# Altium schematic sheet electronic_dc_load_v1.SchDoc: Electronic DC Load (part 1 of 3)
size C; CompanyName: @naifaljohani; Engineer: Naif Aljohani; Revision: 1.1; SheetNumber: 1; SheetTotal: 1; Project: bb; ENG_APP_DATE: --/--/--; DSN_APP_DATE: --/--/--; CHK_APP_DATE: --/--/--
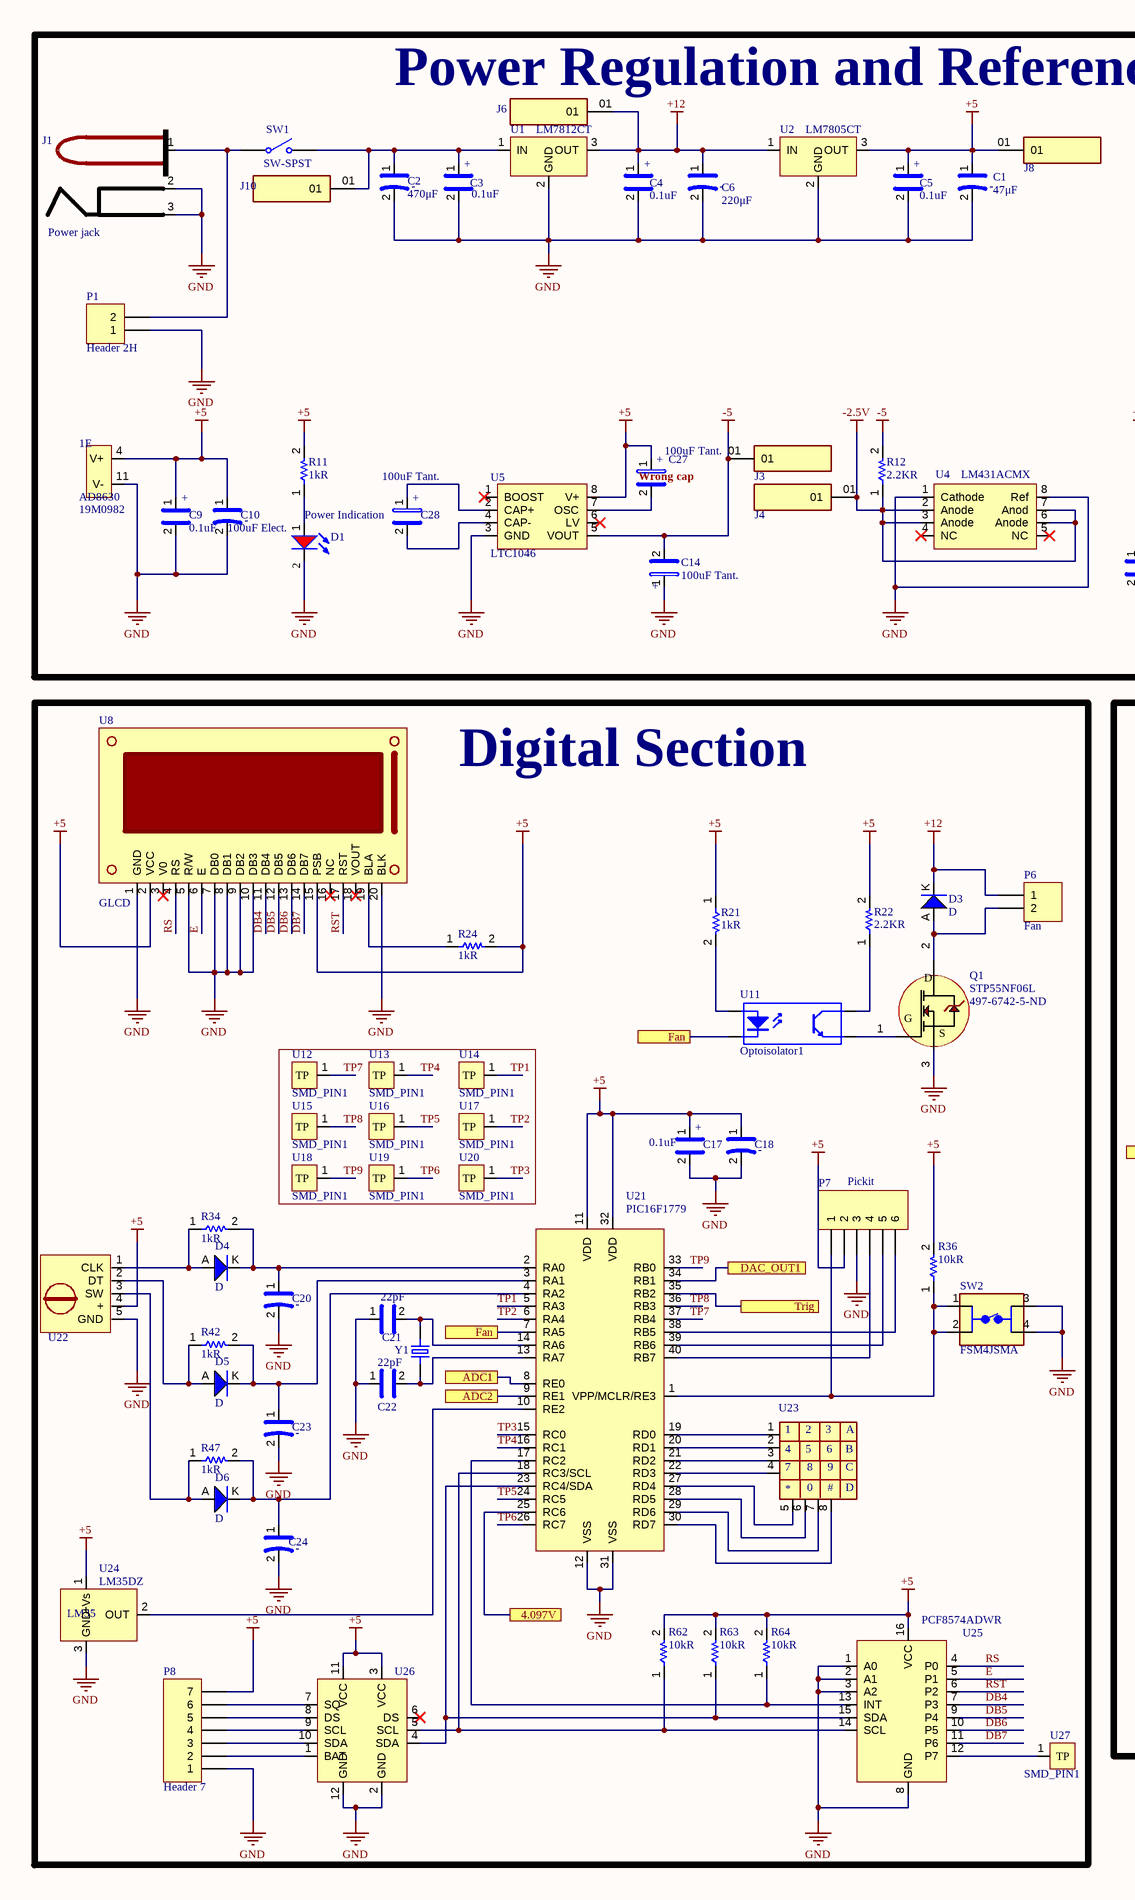
[diagram p0: electronic_dc_load_v1.SchDoc, left]
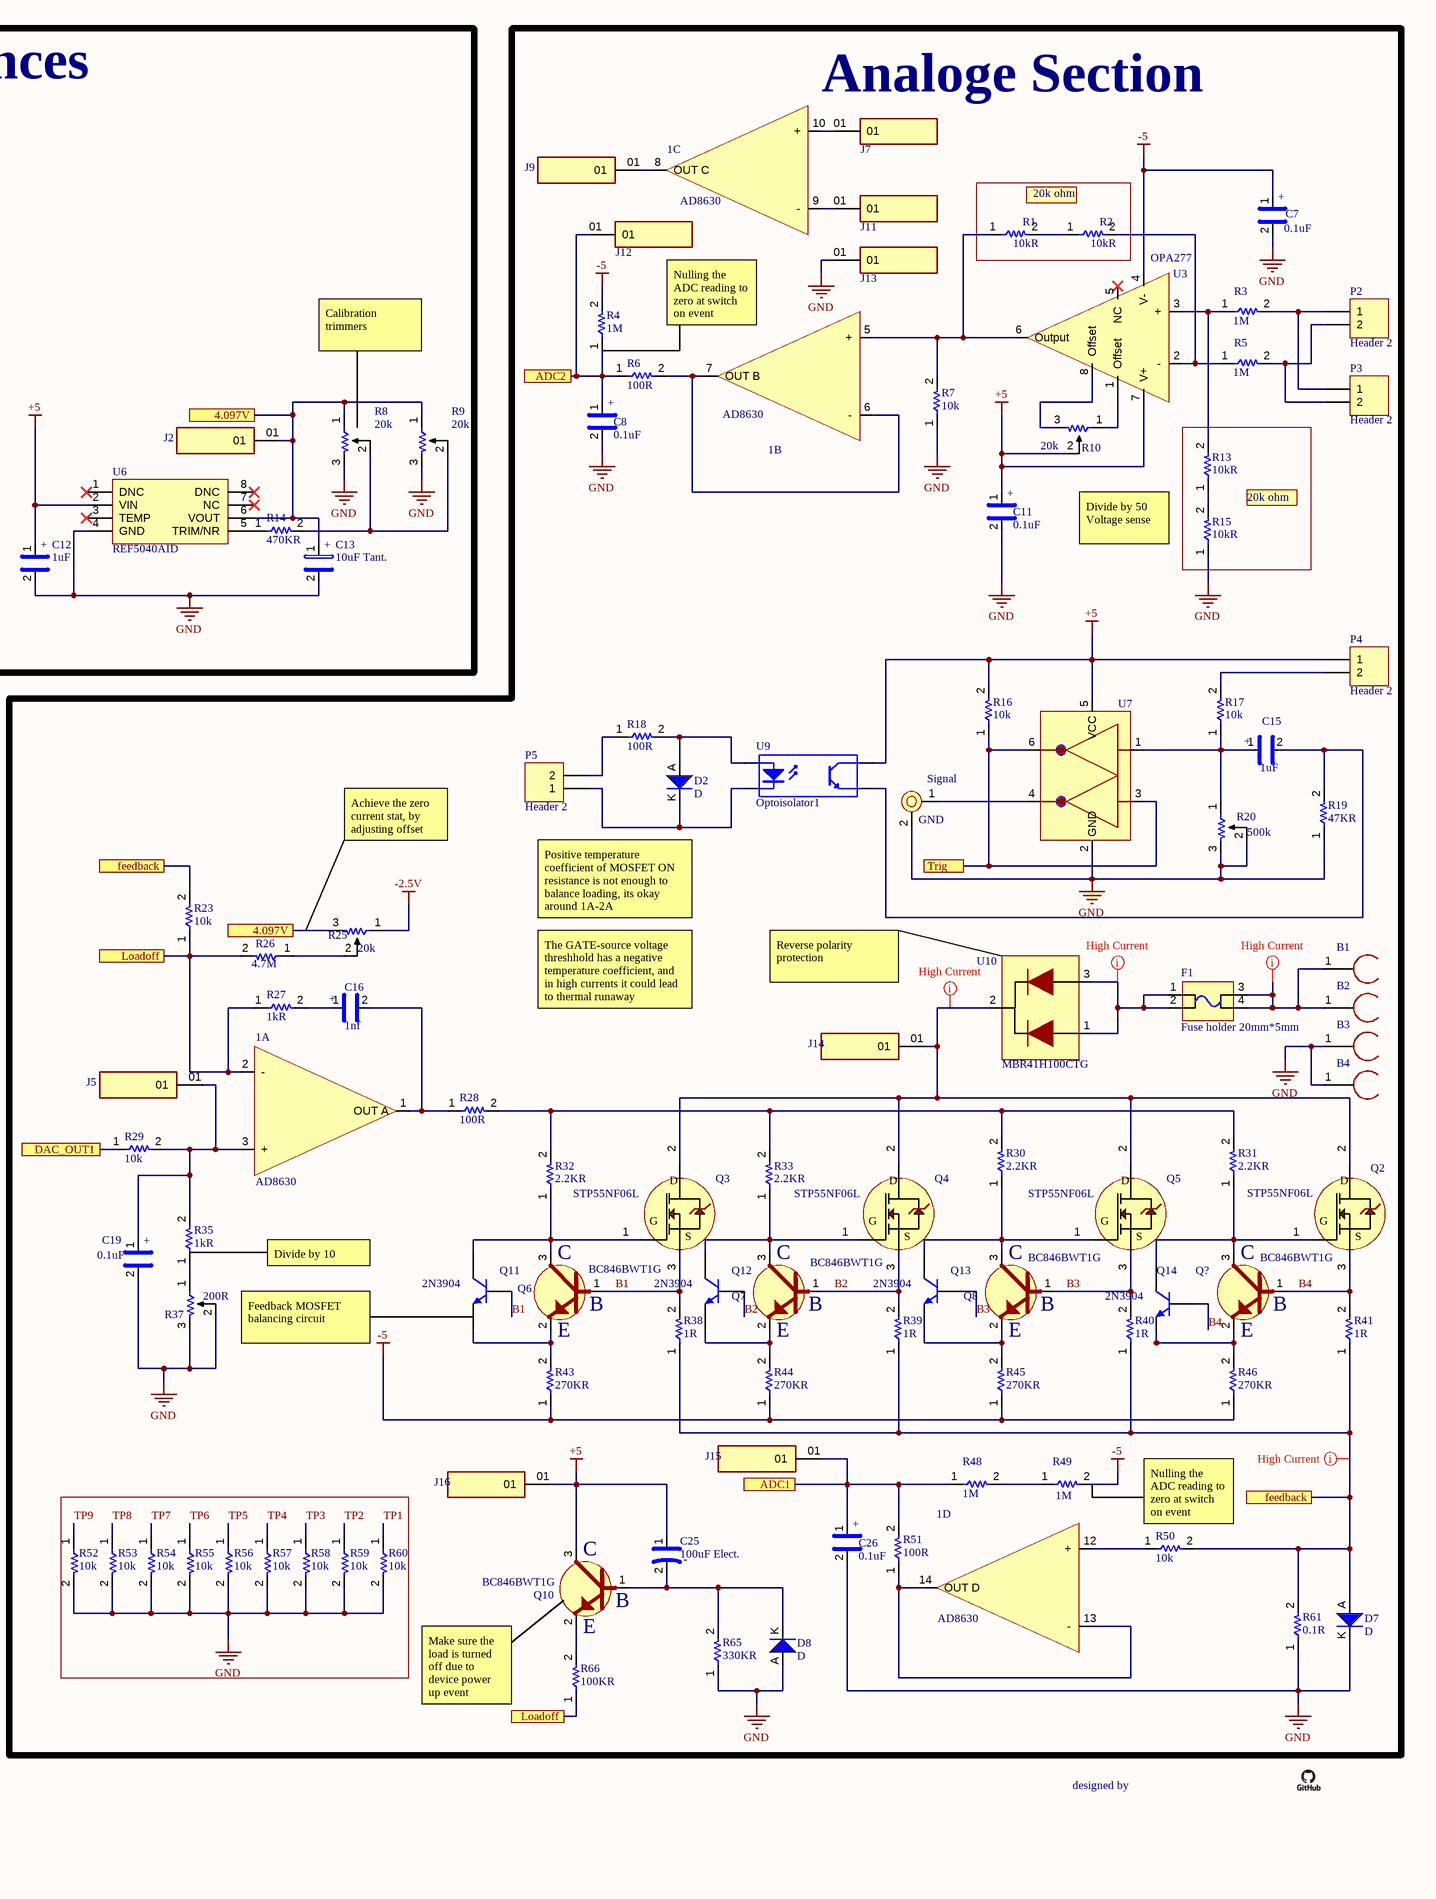
[diagram p1: electronic_dc_load_v1.SchDoc, right]

## Parts
1  AD8630  [SOIC127P600X265-14N]  (parts A,B,C,D,E of 5)
4  031-71052  [PNC-031-71052]  (value not drawn)
B1  BANANA JACK  [banana jack]  (value not drawn)
B2  BANANA JACK  [banana jack]  (value not drawn)
B3  BANANA JACK  [banana jack]  (value not drawn)
B4  BANANA JACK  [banana jack]  (value not drawn)
C1  47μF  [Capacitor-47uf]
C2  470μF  [Capacitor-470uf]
C3  0.1uF  [RESC2012X06N]
C4  0.1uF  [RESC2012X06N]
C5  0.1uF  [RESC2012X06N]
C6  220μF  [Capacitor-470uf]
C7  0.1uF  [RESC2012X06N]
C8  0.1uF  [RESC2012X06N]
C9  0.1uF  [RESC2012X06N]
C10  100uF Elect.  [CAPAE9183X102M]
C11  0.1uF  [RESC2012X06N]
C12  1uF  [RESC3216X06N]
C13  10uF Tant.  [CAPCP6032X20N-10uf Tant.]
C14  100uF Tant.  [CAPCP7343X24N-100uf Tant.]
C15  1uF  [RESC3216X06N]
C16  1nf  [R82EC1100AA50J]
C17  0.1uF  [RESC2012X06N]
C18  100uF Elect.  [CAPAE9183X102M]  (value not drawn)
C19  0.1uF  [RESC2012X06N]
C20  100uF Elect.  [CAPAE9183X102M]  (value not drawn)
C21  22pF  [CAPC3028X26N]
C22  22pF  [CAPC3028X26N]
C23  100uF Elect.  [CAPAE9183X102M]  (value not drawn)
C24  100uF Elect.  [CAPAE9183X102M]  (value not drawn)
C25  100uF Elect.  [CAPAE9183X102M]
C26  0.1uF  [RESC2012X06N]
C27  100uF Tant.  [CAPCP7343X24N-100uf Tant.]
C28  100uF Tant.  [CAPCP7343X24N-100uf Tant.]
D1  15-21SURC/S530-A3/TR8  [Diode]  (value not drawn)
D2  D  [Diode_Through hole]
D3  D  [Diode_Through hole]
D4  D  [Diode_Through hole]
D5  D  [Diode_Through hole]
D6  D  [Diode_Through hole]
D7  D  [Diode_Through hole]
D8  D  [Diode_Through hole]
F1  Fuse holder 20mm*5mm  [Fuse holder 5mm*20mm]
J1  Power jack  [DC jack]
J2  TSW-101-24-T-S  [SAMTEC_TSW-101-24-T-S]  (value not drawn)
J3  TSW-101-24-T-S  [SAMTEC_TSW-101-24-T-S]  (value not drawn)
J4  TSW-101-24-T-S  [SAMTEC_TSW-101-24-T-S]  (value not drawn)
J5  TSW-101-24-T-S  [SAMTEC_TSW-101-24-T-S]  (value not drawn)
J6  TSW-101-24-T-S  [SAMTEC_TSW-101-24-T-S]  (value not drawn)
J7  TSW-101-24-T-S  [SAMTEC_TSW-101-24-T-S]  (value not drawn)
J8  TSW-101-24-T-S  [SAMTEC_TSW-101-24-T-S]  (value not drawn)
J9  TSW-101-24-T-S  [SAMTEC_TSW-101-24-T-S]  (value not drawn)
J10  TSW-101-24-T-S  [SAMTEC_TSW-101-24-T-S]  (value not drawn)
J11  TSW-101-24-T-S  [SAMTEC_TSW-101-24-T-S]  (value not drawn)
J12  TSW-101-24-T-S  [SAMTEC_TSW-101-24-T-S]  (value not drawn)
J13  TSW-101-24-T-S  [SAMTEC_TSW-101-24-T-S]  (value not drawn)
J14  TSW-101-24-T-S  [SAMTEC_TSW-101-24-T-S]  (value not drawn)
J15  TSW-101-24-T-S  [SAMTEC_TSW-101-24-T-S]  (value not drawn)
J16  TSW-101-24-T-S  [SAMTEC_TSW-101-24-T-S]  (value not drawn)
P1  Header 2H  [HDR1X2H]
P2  Header 2  [HDR1X2]
P3  Header 2  [HDR1X2]
P4  Header 2  [HDR1X2]
P5  Header 2  [HDR1X2]
P6  Fan  [HDR1X2]
P7  Pickit  [HDR1X6]
P8  Header 7  [HDR1X7]
Q1  STP55NF06L  Supplier Part Number 1: 497-6742-5-ND  [TO-220-3]
Q2  STP55NF06L  [TO-220-3]
Q3  STP55NF06L  [TO-220-3]
Q4  STP55NF06L  [TO-220-3]
Q5  STP55NF06L  [TO-220-3]
Q6  BC846BWT1G  [SOT65P245X110-3N]
Q7  BC846BWT1G  [SOT65P245X110-3N]
Q8  BC846BWT1G  [SOT65P245X110-3N]
Q10  BC846BWT1G  [SOT65P245X110-3N]
Q11  2N3904  [TO-92A]
Q12  2N3904  [TO-92A]
Q13  2N3904  [TO-92A]
Q14  2N3904  [TO-92A]
Q?  BC846BWT1G  [SOT65P245X110-3N]
R1  10kR  [RESC2012X06N]
R2  10kR  [RESC2012X06N]
R3  1M  [RESC3216X06N]
R4  1M  [RESC3216X06N]
R5  1M  [RESC3216X06N]
R6  100R  [RESC1518X26N]
R7  10k  [RESC2012X06N]
R8  20k  [3296Y_Trimmer]
R9  20k  [3296Y_Trimmer]
R10  20k  [3296Y_Trimmer]
R11  1kR  [RESC1518X26N]
R12  2.2KR  [RESC1518X26N]
R13  10kR  [RESC2012X06N]
R14  470KR  [RESC1518X26N]
R15  10kR  [RESC2012X06N]
R16  10k  [RESC2012X06N]
R17  10k  [RESC2012X06N]
R18  100R  [RESC1518X26N]
R19  47KR  [RESC1518X26N]
R20  500k  [3296Y_Trimmer]
R21  1kR  [RESC1518X26N]
R22  2.2KR  [RESC1518X26N]
R23  10k  [RESC2012X06N]
R24  1kR  [RESC1518X26N]
R25  20k  [3296Y_Trimmer]
R26  4.7M  [RESC3216X06N]
R27  1kR  [RESC1518X26N]
R28  100R  [RESC1518X26N]
R29  10k  [RESC2012X06N]
R30  2.2KR  [RESC1518X26N]
R31  2.2KR  [RESC1518X26N]
R32  2.2KR  [RESC1518X26N]
R33  2.2KR  [RESC1518X26N]
R34  1kR  [RESC1518X26N]
R35  1kR  [RESC1518X26N]
R36  10kR  [RESC2012X06N]
R37  200R  [3296Y_Trimmer]
R38  1R  [RESC296132X130N]
R39  1R  [RESC296132X130N]
R40  1R  [RESC296132X130N]
R41  1R  [RESC296132X130N]
R42  1kR  [RESC1518X26N]
R43  270KR  [RESC1518X26N]
R44  270KR  [RESC1518X26N]
R45  270KR  [RESC1518X26N]
R46  270KR  [RESC1518X26N]
R47  1kR  [RESC1518X26N]
R48  1M  [RESC3216X06N]
R49  1M  [RESC3216X06N]
R50  10k  [RESC2012X06N]
R51  100R  [RESC1518X26N]
R52  10k  [RESC2012X06N]
R53  10k  [RESC2012X06N]
R54  10k  [RESC2012X06N]
R55  10k  [RESC2012X06N]
R56  10k  [RESC2012X06N]
R57  10k  [RESC2012X06N]
R58  10k  [RESC2012X06N]
R59  10k  [RESC2012X06N]
R60  10k  [RESC2012X06N]
R61  0.1R  [TO-220 - 2 PIN]
R62  10kR  [RESC2012X06N]
R63  10kR  [RESC2012X06N]
R64  10kR  [RESC2012X06N]
R65  330KR  [RESC1518X26N]
R66  100KR  [RESC1518X26N]
SW1  SW-SPST  [SPST-2]
SW2  FSM4JSMA  [TE_FSM4JSMA]
U1  LM7812CT  [TO-220-3]
U2  LM7805CT  [TO-220-3]
U3  OPA277  [SOIC127P600X265-8L]
U4  LM431ACMX  [SOIC127P600X265-8L]
U5  LTC1046  [SOIC127P600X265-8L]
U6  REF5040AID  [SOIC127P600X265-8L]
U7  SN74LVC2G14DBVR  [SOT95P245X110-6N]  (value not drawn)
U8  GLCD  [20 PIN- 2.54mm]
U9  Optoisolator1  [DIP-4]
U10  MBR41H100CTG  [TO-220-3]
U11  Optoisolator1  [DIP-4]
U12  SMD_PIN1  [TP_SMD]
U13  SMD_PIN1  [TP_SMD]
U14  SMD_PIN1  [TP_SMD]
U15  SMD_PIN1  [TP_SMD]
U16  SMD_PIN1  [TP_SMD]
U17  SMD_PIN1  [TP_SMD]
U18  SMD_PIN1  [TP_SMD]
U19  SMD_PIN1  [TP_SMD]
U20  SMD_PIN1  [TP_SMD]
U21  PIC16F1779  [DIP40 - duplicate]
U22  Rotary Encoder Module  [5 PIN-2.54mm]  (value not drawn)
U23  27899  [8 pin component_2.54mm pitch]  (value not drawn)
U24  LM35DZ  [TO-220-3]
U25  PCF8574ADWR  [SOIC127P1650X265-16L]
U26  DS1307-Tiny RTC Modul  [DS1307-Tiny RTC Modul]  (value not drawn)
U27  SMD_PIN1  [TP_SMD]
Y1  ABM7-16.000MHZ-D2Y-T  [XTAL_ABM7-16.000MHZ-D2Y-T]  (value not drawn)

## Blocks framed on the sheet
Power Regulation and References: 1 C1-C6 C9 C10 C12-C14 C27 C28 D1 J1-J4 J6 J8 J10 P1 R8 R9 R11 R12 R14 SW1 U1 U2 U4-U6
Analoge Section: 1 4 B1-B4 C7 C8 C11 C15 C16 C19 C25 C26 D2 D7 D8 F1 J5 J7 J9 J11-J16 P2-P5 Q2-Q8 Q10-Q14 Q? R3-R7 R10 R16-R20 R23 R25-R33 R35 R37-R41 R43-R46 R48-R61 R65 R66 U3 U7 U9 U10
20k ohm: R1 R2
20k ohm: R13 R15
Digital Section: C17 C18 C20-C24 D3-D6 P6-P8 Q1 R21 R22 R24 R34 R36 R42 R47 R62-R64 SW2 U8 U11-U27 Y1

## Ports
4.097V, ADC1, ADC2, DAC_OUT1, Fan, feedback, Loadoff, Trig

## Nets
+5: 1.4(V+) C1.1 C5.1 C9.1 C10.1 C11.1 C12.1 C17.1 C18.1 C25.1 C27.1 J8.01 J16.01 P4.1 P7.2 P8.7 Q10.3 R10.2 R11.2 R16.2 R21.1 R22.2 R24.2 R36.2 R62.2 R63.2 R64.2 U2.3(OUT) U3.7(V+) U5.8(V+) U6.2(VIN) U7.5(VCC) U8.2(VCC) U8.15(PSB) U9.4(C) U21.11(VDD) U21.32(VDD) U22.4(+) U24.1(+Vs) U25.16(VCC) U26.3(VCC) U26.11(VCC)
+12: C4.1 C6.1 D3.K J6.01 P6.1 U1.3(OUT) U2.1(IN)
-2.5V: J4.01 R12.1 R25.1 U4.2(Anode) U4.3(Anode) U4.6(Anode) U4.7(Anod)
-5: C7.1 C14.2 J3.01 R4.2 R12.2 R43.1 R44.1 R45.1 R46.1 R49.2 U3.4(V-) U5.5(VOUT)
GND: 1.11(V-) 4.2 B3.1 B4.1 C1.2 C2.2 C3.2 C4.2 C5.2 C6.2 C7.2 C8.2 C9.2 C10.2 C11.2 C12.2 C13.2 C14.1 C17.2 C18.2 C19.2 C20.2 C21.1 C22.1 C23.2 C24.2 C26.2 D1.2(K) D7.K D8.A J1.2 J1.3 J13.01 P1.1 P7.3 P8.1 Q1.3 R7.1 R8.3 R9.3 R15.1 R19.1 R20.2 R20.3 R37.2 R37.3 R52.2 R53.2 R54.2 R55.2 R56.2 R57.2 R58.2 R59.2 R60.2 R61.1 R65.1 SW2.3 SW2.4 U1.2(GND) U2.2(GND) U4.1(Cathode) U4.8(Ref) U5.3(GND) U6.4(GND) U7.2(GND) U8.1(GND) U8.5(R/W) U8.7(DB0) U8.8(DB1) U8.9(DB2) U8.10(DB3) U8.20(BLK) U21.12(VSS) U21.31(VSS) U22.5(GND) U24.3(GND) U25.1(A0) U25.2(A1) U25.3(A2) U25.8(GND) U26.2(GND) U26.12(GND)
4.097V: C13.1 J2.01 R8.1 R9.1 R25.3 U6.6(VOUT) U21.25(RC6) ; port 4.097V
ADC1: C26.1 J15.01 R48.1 R51.2 U21.8(RE0) ; port ADC1
ADC2: C8.1 J12.01 R4.1 R6.1 U21.9(RE1) ; port ADC2
B1: Q3.3 Q6.1 Q11.2(B) R38.2
B2: Q4.3 Q7.1 Q12.2(B) R39.2
B3: Q5.3 Q8.1 Q13.2(B) R40.2
B4: Q2.3 Q14.2(B) Q?.1 R41.2
DAC_OUT1: R29.1 U21.34(RB1) ; port DAC_OUT1
DB4: U8.11(DB4) U25.7(P3)
DB5: U8.12(DB5) U25.9(P4)
DB6: U8.13(DB6) U25.10(P5)
DB7: U8.14(DB7) U25.11(P6)
E: U8.6(E) U25.5(P1)
Fan: U11.2(K) U21.7(RA5) ; port Fan
feedback: D7.A R23.2 R38.1 R39.1 R40.1 R41.1 R50.2 R61.2 ; port feedback
Loadoff: 1.2(-) R23.1 R26.2 R27.1 R66.1 ; port Loadoff
RS: U8.4(RS) U25.4(P0)
RST: U8.17(RST) U25.6(P2)
TP1: R60.1 U14.1(TP) U21.5(RA3)
TP2: R59.1 U17.1(TP) U21.6(RA4)
TP3: R58.1 U20.1(TP) U21.15(RC0)
TP4: R57.1 U13.1(TP) U21.16(RC1)
TP5: R56.1 U16.1(TP) U21.24(RC5)
TP6: R55.1 U19.1(TP) U21.26(RC7)
TP7: R54.1 U12.1(TP) U21.37(RB4)
TP8: R53.1 U15.1(TP) U21.36(RB3)
TP9: R52.1 U18.1(TP) U21.33(RB0)
Trig: R16.1 U7.3 U7.6 U21.35(RB2) ; port Trig
Net1_1: 1.1(OUT_A) C16.2 R28.1
Net1_3: 1.3(+) C19.1 J5.01 R29.2 R35.2
Net1_5: 1.5(+) R1.1 R7.2 U3.6(Output)
Net1_6: 1.6(-) 1.7(OUT_B) R6.2
Net1_8: 1.8(OUT_C) J9.01
Net1_9: 1.9(-) J11.01
Net1_10: 1.10(+) J7.01
Net1_12: 1.12(+) R50.1
Net1_13: 1.13(-) 1.14(OUT_D) R51.1
Net4_1: 4.1(+) U7.4
NetB1_1: B1.1 B2.1 F1.3 F1.4
NetC2_1: C2.1 C3.1 J10.01 SW1.2(NO) U1.1(IN)
NetC15_1: C15.1 R17.1 R20.1 U7.1
NetC15_2: C15.2 R19.2 U9.3(E)
NetC16_1: C16.1 R27.2
NetC20_1: C20.1 D4.K R34.2 U21.2(RA0)
NetC21_2: C21.2 U21.14(RA6) Y1.2
NetC22_2: C22.2 U21.13(RA7) Y1.1
NetC23_1: C23.1 D5.K R42.2 U21.3(RA1)
NetC24_1: C24.1 D6.K R47.2 U21.4(RA2)
NetC25_2: C25.2 D8.K Q10.1 R65.2
NetC27_2: C27.2 U5.7(OSC)
NetC28_1: C28.1 U5.2(CAP+)
NetC28_2: C28.2 U5.4(CAP-)
NetD1_1: D1.1(A) R11.1
NetD2_A: D2.A R18.2 U9.1(A)
NetD2_K: D2.K P5.1 U9.2(K)
NetD3_A: D3.A P6.2 Q1.2
NetD4_A: D4.A R34.1 U22.1(CLK)
NetD5_A: D5.A R42.1 U22.2(DT)
NetD6_A: D6.A R47.1 U22.3(SW)
NetF1_1: F1.1 F1.2 U10.1 U10.3
NetJ1_1: J1.1 P1.2 SW1.1(COMMON)
NetJ14_01: J14.01 Q2.2 Q3.2 Q4.2 Q5.2 U10.2
NetP2_1: P2.1 P3.1 R3.2
NetP2_2: P2.2 P3.2 R5.2
NetP4_2: P4.2 R17.2
NetP5_2: P5.2 R18.1
NetP7_1: P7.1 R36.1 SW2.1 SW2.2 U21.1(VPP/MCLR/RE3)
NetP7_4: P7.4 U21.40(RB7)
NetP7_5: P7.5 U21.39(RB6)
NetP7_6: P7.6 U21.38(RB5)
NetP8_2: P8.2 U26.1(BAT)
NetP8_3: P8.3 U26.10(SDA)
NetP8_4: P8.4 U26.9(SCL)
NetP8_5: P8.5 U26.8(DS)
NetP8_6: P8.6 U26.7(SQ)
NetQ1_1: Q1.1(G) U11.3(E)
NetQ2_1: Q2.1(G) Q14.3(C) Q?.3 R31.1
NetQ3_1: Q3.1(G) Q6.3 Q11.3(C) R32.1
NetQ4_1: Q4.1(G) Q7.3 Q12.3(C) R33.1
NetQ5_1: Q5.1(G) Q8.3 Q13.3(C) R30.1
NetQ6_2: Q6.2 Q11.1(E) R43.2
NetQ7_2: Q7.2 Q12.1(E) R44.2
NetQ8_2: Q8.2 Q13.1(E) R45.2
NetQ10_2: Q10.2 R66.2
NetQ14_1: Q14.1(E) Q?.2 R46.2
NetR1_2: R1.2 R2.1
NetR2_2: R2.2 R5.1 U3.2(-)
NetR3_1: R3.1 R13.2 U3.3(+)
NetR8_2: R8.2 R9.2 R14.2
NetR10_1: R10.1 U3.1(Offset)
NetR10_3: R10.3 U3.8(Offset)
NetR13_1: R13.1 R15.2
NetR14_1: R14.1 U6.5(TRIM/NR)
NetR21_2: R21.2 U11.1(A)
NetR22_1: R22.1 U11.4(C)
NetR24_1: R24.1 U8.19(BLA)
NetR25_2: R25.2 R26.1
NetR28_2: R28.2 R30.2 R31.2 R32.2 R33.2
NetR35_1: R35.1 R37.1
NetR48_2: R48.2 R49.1
NetR62_1: R62.1 U21.18(RC3/SCL) U25.14(SCL) U26.5(SCL)
NetR63_1: R63.1 U21.23(RC4/SDA) U25.15(SDA) U26.4(SDA)
NetR64_1: R64.1 U21.17(RC2) U25.13(INT)
NetU21_10: U21.10(RE2) U24.2(OUT)
NetU21_19: U21.19(RD0) U23.1
NetU21_20: U21.20(RD1) U23.2
NetU21_21: U21.21(RD2) U23.3
NetU21_22: U21.22(RD3) U23.4
NetU21_27: U21.27(RD4) U23.5
NetU21_28: U21.28(RD5) U23.6
NetU21_29: U21.29(RD6) U23.7
NetU21_30: U21.30(RD7) U23.8
NetU25_12: U25.12(P7) U27.1(TP)

Not connected (* = marked no-connect by the designer): U3 5(NC)*; U4 4(NC)* 5(NC)*; U5 1(BOOST)* 6(LV)*; U6 1(DNC)* 3(TEMP)* 7(NC)* 8(DNC)*; U8 3(V0)* 16(NC)* 18(VOUT)*; U26 6(DS)*

## Layout directives
rule Width Constraint [Pref Width = 5mm    Min Width = 3mm    Max Width = 5mm]: NetB1_1
rule Width Constraint [Pref Width = 3mm    Min Width = 1mm    Max Width = 5mm]: feedback, NetF1_1, NetJ14_01

## Notes on the sheet
- (near 1) Nulling the ADC reading to zero at switch on event
- Calibration trimmers
- Power Indication
- (near C27) Wrong cap
- Divide by 50
  Voltage sense
- Achieve the zero current stat, by adjusting offset
- Positive temperature coefficient of MOSFET ON resistance is not enough to balance loading, its okay around 1A-2A
- The GATE-source voltage threshhold has a negative temperature coefficient, and in high currents it could lead to thermal runaway
- Reverse polarity protection
- Divide by 10
- (near R37) Feedback MOSFET balancing circuit
- (near R50) Nulling the ADC reading to zero at switch on event
- Make sure the load is turned off due to device power up event
- designed by
- DWG. NO.
- REV.
- SHT.
- THIS DOCUMENT AND THE DATA DISCLOSED HEREIN OR HEREWITH IS THE PROPERTY OF ALTIUM LIMITED AND MAY BE FREELY DISTRIBUTED IN WHOLE. NO RIGHTS ARE RESERVED OR EXPRESS OR IMPLIED WARANTEE GIVEN.
- REVISION
- DESCRIPTION
- DATE
- APPROVED
- ENG:
- APPROVALS
- PROJECT
- DSN:
- CHK:
- REFERENCE DOCUMENTS
- PROJECT REVISION:
- TITLE
- DOCUMENT REVISION:
- DESIGN ITEM:
- BOM:
- FAB DWG:
- PCB DWG:
- ASSY DWG:
- SCALE:
- SIZE
- B
- CAGE CODE
- FILE NAME
- DWG NO.
- SHEET
- OF
- REV
- (in symbol 0.1uF) +
- (in symbol 1nf) +
- (in symbol 1uF) +
- (in symbol 10uF Tant.) +
- (in symbol 031-71052) Signal; GND
- (in symbol 47μF) -
- (in symbol 100uF Elect.) -
- (in symbol 100uF Tant.) +
- (in symbol 220μF) -
- (in symbol 470μF) -
- (in symbol 27899) A; B; 9; C; 0; #; D
- (in symbol BC846BWT1G) C; B; E
- (in symbol STP55NF06L) D; S